# Altium schematic sheet [10] - ETHERNET.SchDoc: IMXBB
size A3; DocumentNumber: 10; Revision: 2.0; SheetNumber: 10; SheetTotal: 13
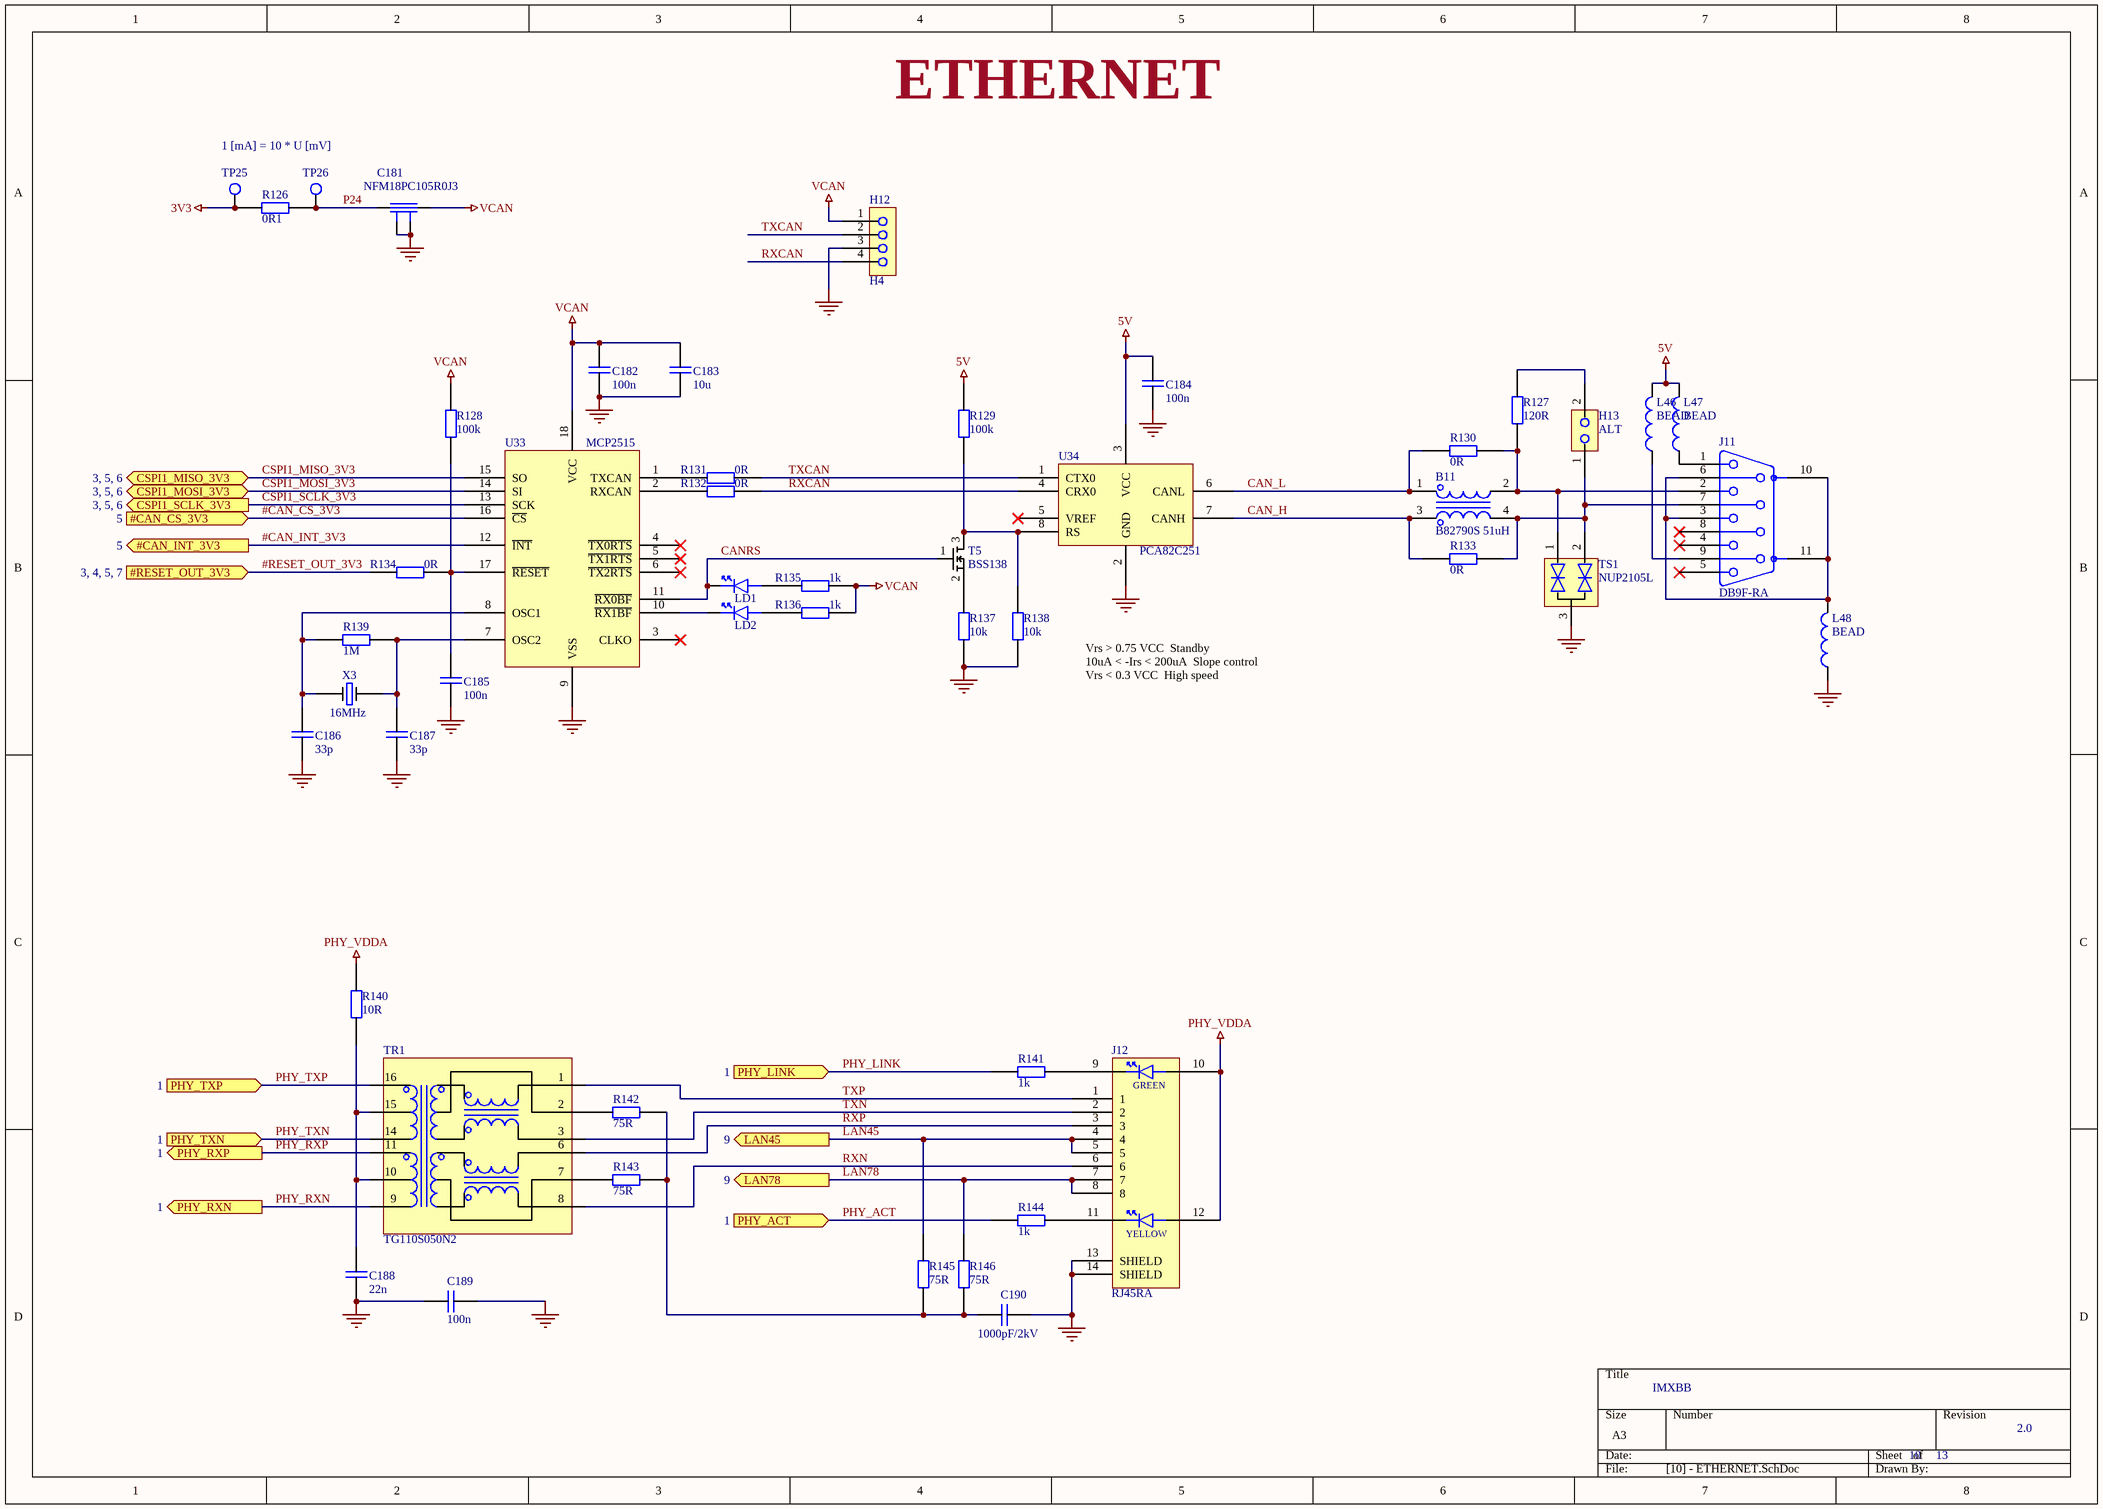
[diagram p0: [10] - ETHERNET.SchDoc]

## Parts
B11  B82790S 51uH  [B82790]
C181  NFM18PC105R0J3  [NFM18P]
C182  100n  [0603]
C183  10u  [0805]
C184  100n  [0603]
C185  100n  [0603]
C186  33p  [0603]
C187  33p  [0603]
C188  22n  [0603]
C189  100n  [0603]
C190  1000pF/2kV  [1n]
H12  H4  [H1x4]
H13  ALT  [H1x2]
J11  DB9F-RA  [DRA9_F]
J12  RJ45RA  [RJ45LED]
L46  BEAD  [0805]
L47  BEAD  [0805]
L48  BEAD  [0603]
LD1  LED  [0805]  (value not drawn)
LD2  LED  [0805]  (value not drawn)
R126  0R1  [0603]
R127  120R  [0603]
R128  100k  [0603]
R129  100k  [0603]
R130  0R  [0603]
R131  0R  [0603]
R132  0R  [0603]
R133  0R  [0603]
R134  0R  [0603]
R135  1k  [0603]
R136  1k  [0603]
R137  10k  [0603]
R138  10k  [0603]
R139  1M  [0603]
R140  10R  [0603]
R141  1k  [0603]
R142  75R  [0603]
R143  75R  [0603]
R144  1k  [0603]
R145  75R  [0603]
R146  75R  [0603]
T5  BSS138  [SOT23]
TP25  TESTPOINT  [TESTPOINT_2mm]  (value not drawn)
TP26  TESTPOINT  [TESTPOINT_2mm]  (value not drawn)
TR1  TG110S050N2  [SOIC16M]
TS1  NUP2105L  [SOT23]
U33  MCP2515  [SOIC18W]
U34  PCA82C251  [SOIC8N]
X3  16MHz  [HC494H]

## Ports
#CAN_CS_3V3 (in, see 5), #CAN_INT_3V3 (out, see 5), #RESET_OUT_3V3 (in, see 3, 4, 5, 7), CSPI1_MISO_3V3 (bidir, see 3, 5, 6), CSPI1_MOSI_3V3 (bidir, see 3, 5, 6), CSPI1_SCLK_3V3 (out, see 3, 5, 6), LAN45 (out, see 9), LAN78 (out, see 9), PHY_ACT (in, see 1), PHY_LINK (in, see 1), PHY_RXN (out, see 1), PHY_RXP (out, see 1), PHY_TXN (in, see 1), PHY_TXP (in, see 1)

## Nets
3V3: R126.1 TP25.1
5V: C184.2 L46.2 L47.2 R129.1 U34.3(VCC)
CASE_GND: C189.1 C190.2 J12.13(SHIELD) J12.14(SHIELD)
GND: C181.2 C181.4 C182.1 C183.1 C184.1 C185.1 C186.1 C187.1 C188.1 C189.2 H12.3 L48.1 R137.2 R138.2 TS1.3 U33.9(VSS) U34.2(GND)
PHY_VDDA: J12.10(D1P) J12.12(D2P) R140.2
VCAN: C181.3 C182.2 C183.2 H12.1 R128.1 R135.1 R136.1 U33.18(VCC)
#CAN_CS_3V3: U33.16(~{CS}) ; port #CAN_CS_3V3
#CAN_INT_3V3: U33.12(~{INT}) ; port #CAN_INT_3V3
#RESET_OUT_3V3: R134.2 ; port #RESET_OUT_3V3
CAN_H: B11.3 R133.1 U34.7(CANH)
CAN_L: B11.1 R130.1 U34.6(CANL)
CANRS: LD1.2(CATHODE) T5.1(G) U33.11(~{RX0BF})
CSPI1_MISO_3V3: U33.15(SO) ; port CSPI1_MISO_3V3
CSPI1_MOSI_3V3: U33.14(SI) ; port CSPI1_MOSI_3V3
CSPI1_SCLK_3V3: U33.13(SCK) ; port CSPI1_SCLK_3V3
LAN45: J12.4 J12.5 R145.2 ; port LAN45
LAN78: J12.7 J12.8 R146.2 ; port LAN78
P24: C181.1 R126.2 TP26.1
PHY_ACT: R144.1 ; port PHY_ACT
PHY_LINK: R141.1 ; port PHY_LINK
PHY_RXN: TR1.9(P10) ; port PHY_RXN
PHY_RXP: TR1.11(P12) ; port PHY_RXP
PHY_TXN: TR1.14(P14) ; port PHY_TXN
PHY_TXP: TR1.16(P16) ; port PHY_TXP
RXCAN: H12.4 R132.1 U34.4(CRX0)
RXN: J12.6 TR1.8(P8)
RXP: J12.3 TR1.6(P6)
TXCAN: H12.2 R131.1 U34.1(CTX0)
TXN: J12.2 TR1.3(P3)
TXP: J12.1 TR1.1(P1)
NetB11_2: B11.2 J11.2 R127.2 R130.2 TS1.1
NetB11_4: B11.4 H13.1 J11.7 R133.2 TS1.2
NetC185_2: C185.2 R128.2 R134.1 U33.17(~{RESET})
NetC186_2: C186.2 R139.2 U33.8(OSC1) X3.1
NetC187_2: C187.2 R139.1 U33.7(OSC2) X3.2
NetC188_2: C188.2 R140.1 TR1.10(P11) TR1.15(CT)
NetC190_1: C190.1 R142.2 R143.2 R145.1 R146.1
NetH13_2: H13.2 R127.1
NetJ11_1: J11.1 L47.1
NetJ11_3: J11.3 J11.6 J11.10(SHIELD) J11.11(SHIELD) L48.2
NetJ11_9: J11.9 L46.1
NetJ12_9: J12.9(D1N) R141.2
NetJ12_11: J12.11(D2N) R144.2
NetLD1_1: LD1.1(ANODE) R135.2
NetLD2_1: LD2.1(ANODE) R136.2
NetLD2_2: LD2.2(CATHODE) U33.10(~{RX1BF})
NetR129_2: R129.2 R138.1 T5.3(D) U34.8(RS)
NetR131_2: R131.2 U33.1(TXCAN)
NetR132_2: R132.2 U33.2(RXCAN)
NetR137_1: R137.1 T5.2(S)
NetR142_1: R142.1 TR1.2(P2)
NetR143_1: R143.1 TR1.7(P7)

Not connected (* = marked no-connect by the designer): J11 4* 5* 8*; U33 3(CLKO)* 4(~{TX0RTS})* 5(~{TX1RTS})* 6(~{TX2RTS})*; U34 5(VREF)*

## Notes on the sheet
- ETHERNET
- 1 [mA] = 10 * U [mV]
- Vrs > 0.75 VCC		Standby
  10uA < -Irs < 200uA		Slope control
  Vrs < 0.3 VCC		High speed
- (in symbol RJ45RA) GREEN; YELLOW

## Library data of the parts
B11 = B82790S: pin to pad: 3>4 4>3
C181 = NFL21S: Chip EMIFIL; Producer: Murata; Order number: NFM18PC105R0J3; Component class: C; Assembly type: SMT
C182-C190 = C
H13 = H2
L46-L48 = FBEAD
R126-R146 = R
TP25 TP26 = TESTPOINT: Testpoint pad; Order number: no component; Component class: TP; Producer: n/a; Assembly type: no component
X3 = XTAL